# Altium schematic sheet 2015PCB1.SchDoc
size A3
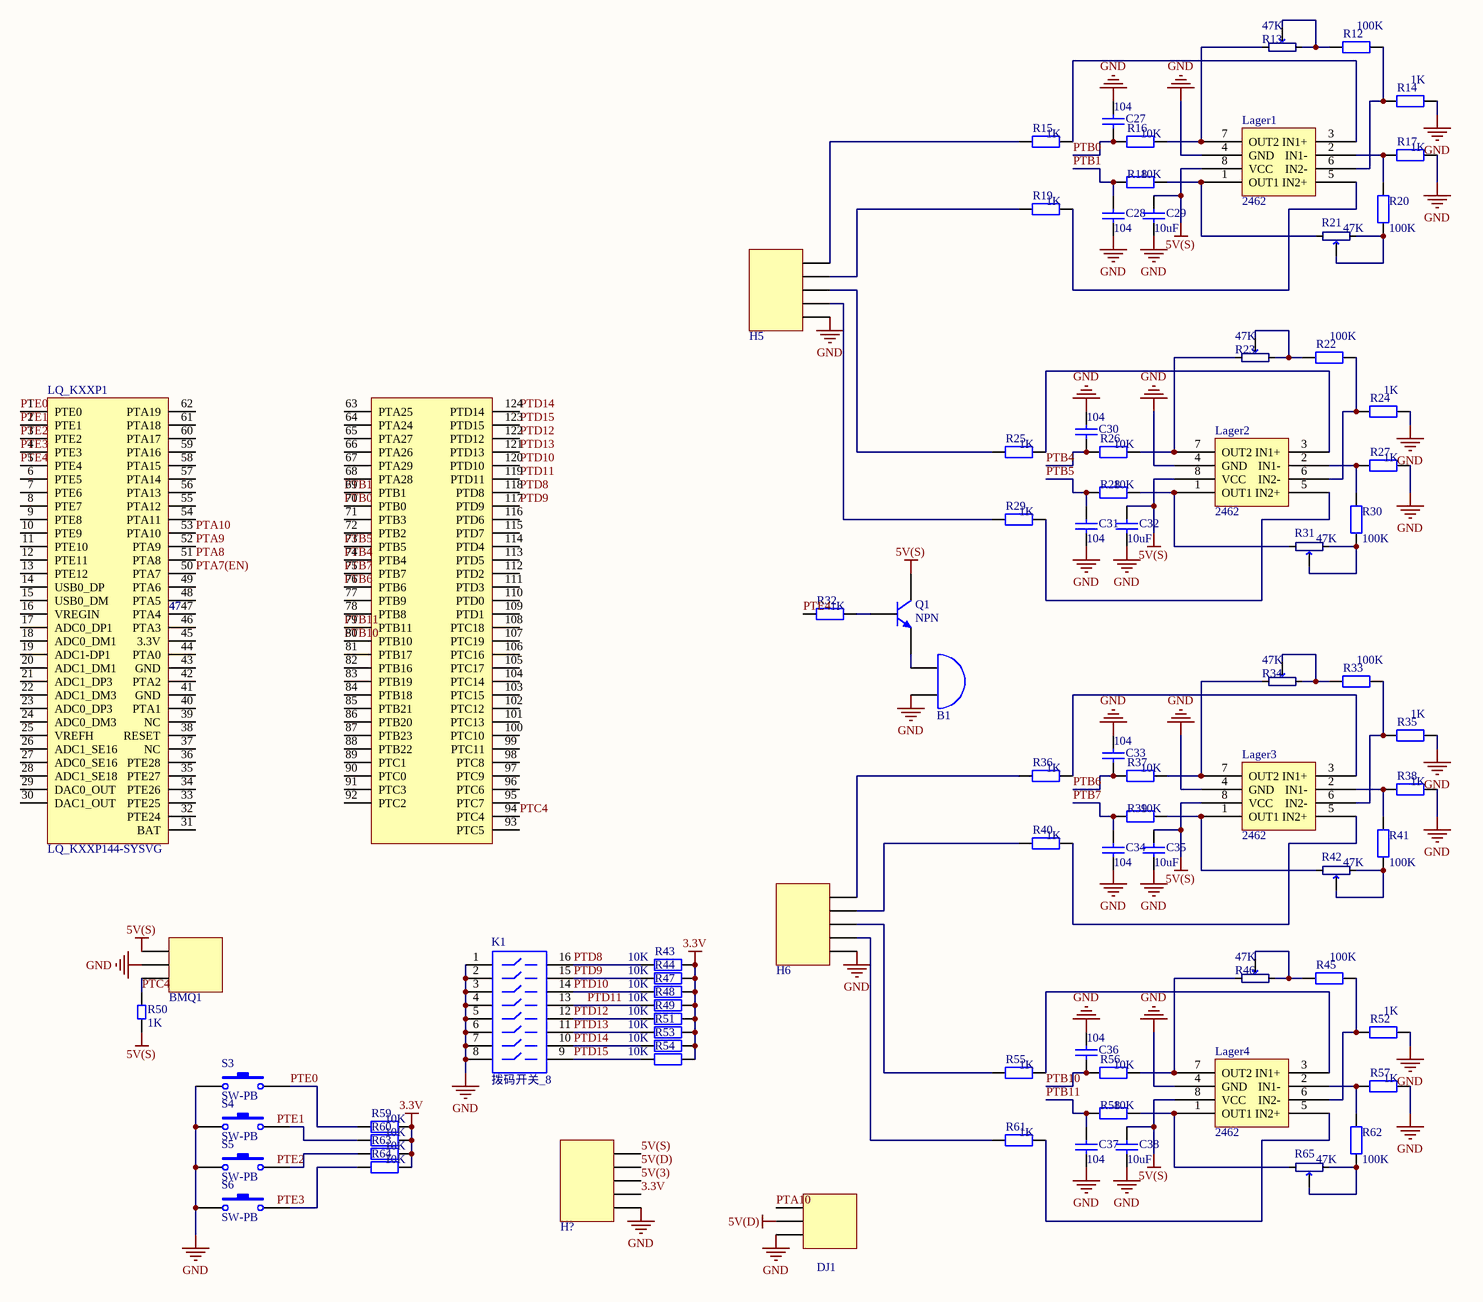
[diagram p0: 2015PCB1.SchDoc]

## Parts
B1  BELL  [bell]  (value not drawn)
BMQ1  HEADER  [干簧管]  (value not drawn)
C27  value 104  [PCBComponent_1]  (hidden comment: Cap)
C28  value 104  [PCBComponent_1]  (hidden comment: Cap)
C29  value 10uF  [PCBComponent_1]  (hidden comment: Cap)
C30  value 104  [PCBComponent_1]  (hidden comment: Cap)
C31  value 104  [PCBComponent_1]  (hidden comment: Cap)
C32  value 10uF  [PCBComponent_1]  (hidden comment: Cap)
C33  value 104  [PCBComponent_1]  (hidden comment: Cap)
C34  value 104  [PCBComponent_1]  (hidden comment: Cap)
C35  value 10uF  [PCBComponent_1]  (hidden comment: Cap)
C36  value 104  [PCBComponent_1]  (hidden comment: Cap)
C37  value 104  [PCBComponent_1]  (hidden comment: Cap)
C38  value 10uF  [PCBComponent_1]  (hidden comment: Cap)
DJ1  HEADER  [干簧管]  (value not drawn)
H5  HEADER  [HEADER5]  (value not drawn)
H6  HEADER  [HEADER5]  (value not drawn)
H?  HEADER  [HEADER5]  (value not drawn)
K1  拨码开关_8  [拨码开关]
Lager1  2462  [SOIC127P600X175-8N]
Lager2  2462  [SOIC127P600X175-8N]
Lager3  2462  [SOIC127P600X175-8N]
Lager4  2462  [SOIC127P600X175-8N]
LQ_KXXP1  LQ_KXXP144-SYSVG  [LQ_KXXP144-SYSVG]
Q1  NPN  [TO-226]
R12  value 100K  [0805]  (hidden comment: Res2)
R13  47K  [精密可调电位器]
R14  value 1K  [0805]  (hidden comment: Res2)
R15  value 1K  [0805]  (hidden comment: Res2)
R16  value 10K  [0805]  (hidden comment: Res2)
R17  value 1K  [0805]  (hidden comment: Res2)
R18  value 10K  [0805]  (hidden comment: Res2)
R19  value 1K  [0805]  (hidden comment: Res2)
R20  value 100K  [0805]  (hidden comment: Res2)
R21  47K  [精密可调电位器]
R22  value 100K  [0805]  (hidden comment: Res2)
R23  47K  [精密可调电位器]
R24  value 1K  [0805]  (hidden comment: Res2)
R25  value 1K  [0805]  (hidden comment: Res2)
R26  value 10K  [0805]  (hidden comment: Res2)
R27  value 1K  [0805]  (hidden comment: Res2)
R28  value 10K  [0805]  (hidden comment: Res2)
R29  value 1K  [0805]  (hidden comment: Res2)
R30  value 100K  [0805]  (hidden comment: Res2)
R31  47K  [精密可调电位器]
R32  value 1K  [0805]  (hidden comment: Res2)
R33  value 100K  [0805]  (hidden comment: Res2)
R34  47K  [精密可调电位器]
R35  value 1K  [0805]  (hidden comment: Res2)
R36  value 1K  [0805]  (hidden comment: Res2)
R37  value 10K  [0805]  (hidden comment: Res2)
R38  value 1K  [0805]  (hidden comment: Res2)
R39  value 10K  [0805]  (hidden comment: Res2)
R40  value 1K  [0805]  (hidden comment: Res2)
R41  value 100K  [0805]  (hidden comment: Res2)
R42  47K  [精密可调电位器]
R43  value 10K  [0805]  (hidden comment: Res2)
R44  value 10K  [0805]  (hidden comment: Res2)
R45  value 100K  [0805]  (hidden comment: Res2)
R46  47K  [精密可调电位器]
R47  value 10K  [0805]  (hidden comment: Res2)
R48  value 10K  [0805]  (hidden comment: Res2)
R49  value 10K  [0805]  (hidden comment: Res2)
R50  value 1K  [0805]  (hidden comment: RES)
R51  value 10K  [0805]  (hidden comment: Res2)
R52  value 1K  [0805]  (hidden comment: Res2)
R53  value 10K  [0805]  (hidden comment: Res2)
R54  value 10K  [0805]  (hidden comment: Res2)
R55  value 1K  [0805]  (hidden comment: Res2)
R56  value 10K  [0805]  (hidden comment: Res2)
R57  value 1K  [0805]  (hidden comment: Res2)
R58  value 10K  [0805]  (hidden comment: Res2)
R59  value 10K  [0805]  (hidden comment: Res2)
R60  value 10K  [0805]  (hidden comment: Res2)
R61  value 1K  [0805]  (hidden comment: Res2)
R62  value 100K  [0805]  (hidden comment: Res2)
R63  value 10K  [0805]  (hidden comment: Res2)
R64  value 10K  [0805]  (hidden comment: Res2)
R65  47K  [精密可调电位器]
S3  SW-PB  [2012[0805]]
S4  SW-PB  [2012[0805]]
S5  SW-PB  [2012[0805]]
S6  SW-PB  [2012[0805]]

## Nets
3.3V: H?.2 R43.2 R44.2 R47.2 R48.2 R49.2 R51.2 R53.2 R54.2 R59.2 R60.2 R63.2 R64.2
5V(D): DJ1.2 H?.4
5V(S): BMQ1.1 C29.1 C32.1 C35.1 C38.1 H?.5 Lager1.8(VCC) Lager2.8(VCC) Lager3.8(VCC) Lager4.8(VCC) Q1.1(C) R50.1
GND: B1.2 BMQ1.2 C27.2 C28.1 C29.2 C30.2 C31.1 C32.2 C33.2 C34.1 C35.2 C36.2 C37.1 C38.2 DJ1.3 H5.1 H6.1 H?.1 K1.1 K1.2 K1.3 K1.4 K1.5 K1.6 K1.7 K1.8 Lager1.4(GND) Lager2.4(GND) Lager3.4(GND) Lager4.4(GND) R14.2 R17.2 R24.2 R27.2 R35.2 R38.2 R52.2 R57.2 S3.1 S4.1 S5.1 S6.1
5V(3): H?.3
PTA7(EN): LQ_KXXP1.50(PTA7)
PTA8: LQ_KXXP1.51(PTA8)
PTA9: LQ_KXXP1.52(PTA9)
PTA10: DJ1.1 LQ_KXXP1.53(PTA10)
PTB0: C27.1 LQ_KXXP1.70(PTB0) R16.1
PTB1: C28.2 LQ_KXXP1.69(PTB1) R18.1
PTB4: C30.1 LQ_KXXP1.74(PTB4) R26.1
PTB5: C31.2 LQ_KXXP1.73(PTB5) R28.1
PTB6: C33.1 LQ_KXXP1.76(PTB6) R37.1
PTB7: C34.2 LQ_KXXP1.75(PTB7) R39.1
PTB10: C36.1 LQ_KXXP1.80(PTB10) R56.1
PTB11: C37.2 LQ_KXXP1.79(PTB11) R58.1
PTC4: BMQ1.3 LQ_KXXP1.94(PTC4) R50.2
PTD8: K1.16 LQ_KXXP1.118(PTD8) R43.1
PTD9: K1.15 LQ_KXXP1.117(PTD9) R44.1
PTD10: K1.14 LQ_KXXP1.120(PTD10) R47.1
PTD11: K1.13 LQ_KXXP1.119(PTD11) R48.1
PTD12: K1.12 LQ_KXXP1.122(PTD12) R49.1
PTD13: K1.11 LQ_KXXP1.121(PTD13) R51.1
PTD14: K1.10 LQ_KXXP1.124(PTD14) R53.1
PTD15: K1.9 LQ_KXXP1.123(PTD15) R54.1
PTE0: LQ_KXXP1.1(PTE0) R59.1 S3.2
PTE1: LQ_KXXP1.2(PTE1)
PTE2: LQ_KXXP1.3(PTE2)
PTE3: LQ_KXXP1.4(PTE3)
PTE4: LQ_KXXP1.5(PTE4) R32.1
NetB1_1: B1.1 Q1.3(E)
NetH5_2: H5.2 R29.1
NetH5_3: H5.3 R25.1
NetH5_4: H5.4 R19.1
NetH5_5: H5.5 R15.1
NetH6_2: H6.2 R61.1
NetH6_3: H6.3 R55.1
NetH6_4: H6.4 R40.1
NetH6_5: H6.5 R36.1
NetLager1_1: Lager1.1(OUT1) R18.2 R21.3
NetLager1_2: Lager1.2(IN1-) R17.1 R20.1
NetLager1_3: Lager1.3(IN1+) R15.2
NetLager1_5: Lager1.5(IN2+) R19.2
NetLager1_6: Lager1.6(IN2-) R12.2 R14.1
NetLager1_7: Lager1.7(OUT2) R13.1 R16.2
NetLager2_1: Lager2.1(OUT1) R28.2 R31.3
NetLager2_2: Lager2.2(IN1-) R27.1 R30.1
NetLager2_3: Lager2.3(IN1+) R25.2
NetLager2_5: Lager2.5(IN2+) R29.2
NetLager2_6: Lager2.6(IN2-) R22.2 R24.1
NetLager2_7: Lager2.7(OUT2) R23.1 R26.2
NetLager3_1: Lager3.1(OUT1) R39.2 R42.3
NetLager3_2: Lager3.2(IN1-) R38.1 R41.1
NetLager3_3: Lager3.3(IN1+) R36.2
NetLager3_5: Lager3.5(IN2+) R40.2
NetLager3_6: Lager3.6(IN2-) R33.2 R35.1
NetLager3_7: Lager3.7(OUT2) R34.1 R37.2
NetLager4_1: Lager4.1(OUT1) R58.2 R65.3
NetLager4_2: Lager4.2(IN1-) R57.1 R62.1
NetLager4_3: Lager4.3(IN1+) R55.2
NetLager4_5: Lager4.5(IN2+) R61.2
NetLager4_6: Lager4.6(IN2-) R45.2 R52.1
NetLager4_7: Lager4.7(OUT2) R46.1 R56.2
NetQ1_2: Q1.2(B) R32.2
NetR12_1: R12.1 R13.2 R13.3
NetR20_2: R20.2 R21.1 R21.2
NetR22_1: R22.1 R23.2 R23.3
NetR30_2: R30.2 R31.1 R31.2
NetR33_1: R33.1 R34.2 R34.3
NetR41_2: R41.2 R42.1 R42.2
NetR45_1: R45.1 R46.2 R46.3
NetR60_1: R60.1 S4.2
NetR62_2: R62.2 R65.1 R65.2
NetR63_1: R63.1 S5.2
NetR64_1: R64.1 S6.2

Not connected (* = marked no-connect by the designer): LQ_KXXP1 6(PTE5) 7(PTE6) 8(PTE7) 9(PTE8) 10(PTE9) 11(PTE10) 12(PTE11) 13(PTE12) 14(USB0_DP) 15(USB0_DM) 16(VREGIN) 17(ADC0_DP1) 18(ADC0_DM1) 19(ADC1-DP1) 20(ADC1_DM1) 21(ADC1_DP3) 22(ADC1_DM3) 23(ADC0_DP3) 24(ADC0_DM3) 25(VREFH) 26(ADC1_SE16) 27(ADC0_SE16) 28(ADC1_SE18) 29(DAC0_OUT) 30(DAC1_OUT) 31(BAT) 32(PTE24) 33(PTE25) 34(PTE26) 35(PTE27) 36(PTE28) 37(NC) 38(RESET) 39(NC) 40(PTA1) 41(GND) 42(PTA2) 43(GND) 44(PTA0) 45(3.3V) 46(PTA3) 47(PTA4) 48(PTA5) 49(PTA6) 54(PTA11) 55(PTA12) 56(PTA13) 57(PTA14) 58(PTA15) 59(PTA16) 60(PTA17) 61(PTA18) 62(PTA19) 63(PTA25) 64(PTA24) 65(PTA27) 66(PTA26) 67(PTA29) 68(PTA28) 71(PTB3) 72(PTB2) 77(PTB9) 78(PTB8) 81(PTB17) 82(PTB16) 83(PTB19) 84(PTB18) 85(PTB21) 86(PTB20) 87(PTB23) 88(PTB22) 89(PTC1) 90(PTC0) 91(PTC3) 92(PTC2) 93(PTC5) 95(PTC7) 96(PTC6) 97(PTC9) 98(PTC8) 99(PTC11) 100(PTC10) 101(PTC13) 102(PTC12) 103(PTC15) 104(PTC14) 105(PTC17) 106(PTC16) 107(PTC19) 108(PTC18) 109(PTD1) 110(PTD0) 111(PTD3) 112(PTD2) 113(PTD5) 114(PTD4) 115(PTD7) 116(PTD6)

## Notes on the sheet
- Labels drawn without touching a wire or pin: PTE1, PTE2, PTE3

## Library data of the parts
B1 = bell: 直插蜂鸣器
BMQ1 DJ1 = HEADER3
C27-C38 = Cap: Capacitor; Published: 8-Jun-2000; LatestRevisionDate: 17-Jul-2002; LatestRevisionNote: Re-released for DXP Platform.; PackageReference: RAD-0.3; Publisher: Altium Limited
H5 H6 H? = HEADER5: CCD接口
Lager1-Lager4 = BTS7970B_3: 驱动
Q1 = NPN: NPN Bipolar Transistor; Published: 8-Jun-2000; LatestRevisionDate: 17-Jul-2002; LatestRevisionNote: Re-released for DXP Platform.; PackageReference: TO-226; Publisher: Altium Limited; Code_JEDEC: TO-226-AA
R12 R14-R20 R22 R24-R30 R32 R33 R35-R41 R43-R45 R47-R49 R51-R64 = Res2: Resistor; Published: 8-Jun-2000; LatestRevisionDate: 17-Jul-2002; LatestRevisionNote: Re-released for DXP Platform.; PackageReference: AXIAL-0.4; Publisher: Altium Limited; PackageDescription: Axial Device, Thru-Hole; 2 Leads; 0.4 in Pin Spacing
R13 R21 R23 R31 R34 R42 R46 R65 = 精密可调电位器
R50 = 0805-电阻
S3-S6 = SW-PB: Switch; Published: 24-Mar-1999; LatestRevisionDate: 17-Jul-2002; LatestRevisionNote: Re-released for DXP Platform.; PackageReference: SPST-2; Publisher: Altium Limited